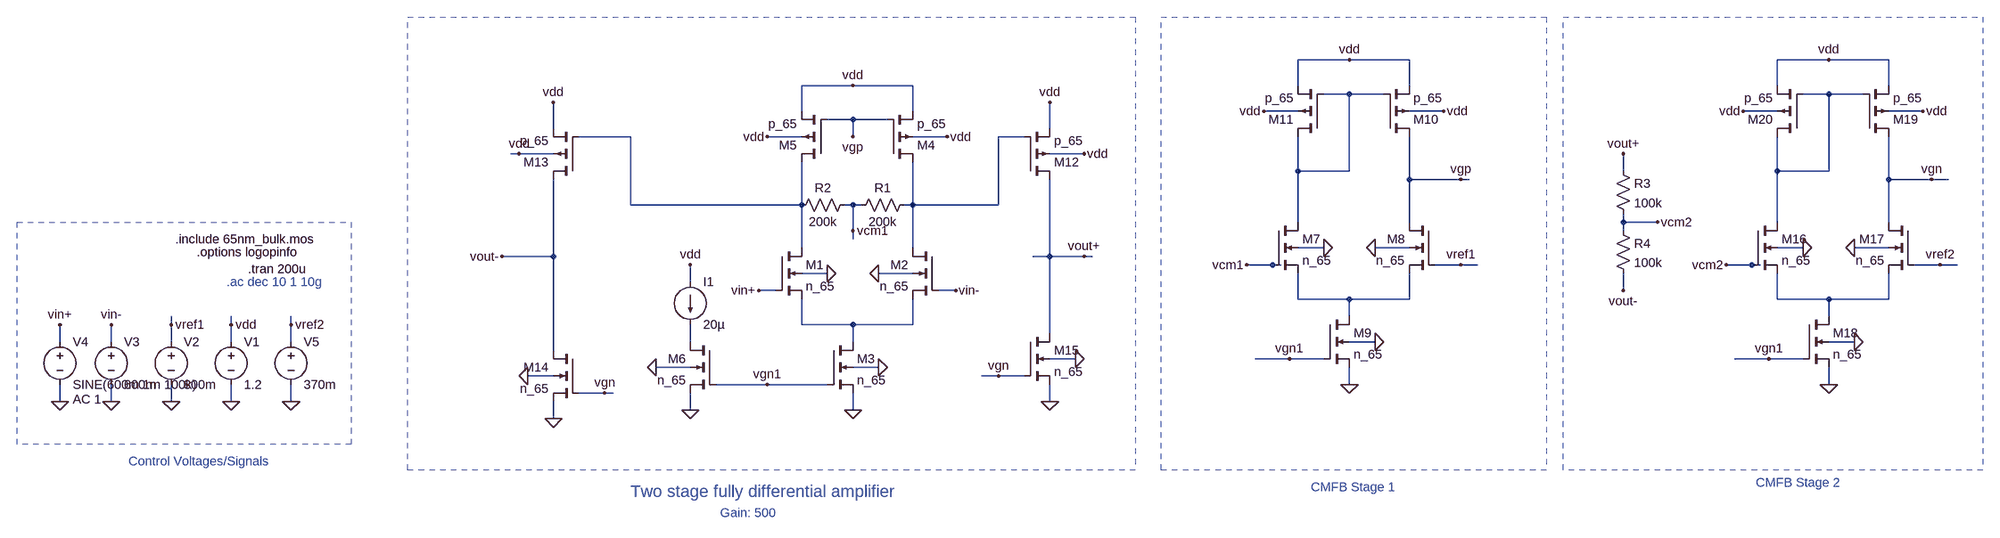
[diagram p0: schematic cmfb.asc]
cmfb.asc, the LTspice schematic file:
Version 4.1
SHEET 1 2388 772
WIRE 1200 -112 1104 -112
WIRE 1312 -112 1200 -112
WIRE 2096 -112 2000 -112
WIRE 2208 -112 2096 -112
WIRE 272 -64 176 -64
WIRE 384 -64 272 -64
WIRE 1104 -64 1104 -112
WIRE 1312 -64 1312 -112
WIRE 2000 -64 2000 -112
WIRE 2208 -64 2208 -112
WIRE 1200 -48 1152 -48
WIRE 1264 -48 1200 -48
WIRE 2096 -48 2048 -48
WIRE 2160 -48 2096 -48
WIRE 176 -16 176 -64
WIRE 384 -16 384 -64
WIRE 1104 -16 1040 -16
WIRE 1376 -16 1312 -16
WIRE 2000 -16 1936 -16
WIRE 2272 -16 2208 -16
WIRE 272 0 224 0
WIRE 336 0 272 0
WIRE -288 16 -288 -32
WIRE 640 16 640 -32
WIRE -144 32 -240 32
WIRE 176 32 112 32
WIRE 272 32 272 0
WIRE 448 32 384 32
WIRE 592 32 544 32
WIRE -352 64 -368 64
WIRE -288 64 -352 64
WIRE 704 64 640 64
WIRE 1104 96 1104 32
WIRE 1200 96 1200 -48
WIRE 1200 96 1104 96
WIRE 1712 96 1712 64
WIRE 2000 96 2000 32
WIRE 2096 96 2096 -48
WIRE 2096 96 2000 96
WIRE 1312 112 1312 32
WIRE 1408 112 1312 112
WIRE 1424 112 1408 112
WIRE 2208 112 2208 32
WIRE 2288 112 2208 112
WIRE 2320 112 2288 112
WIRE -144 160 -144 32
WIRE 176 160 176 80
WIRE 176 160 -144 160
WIRE 272 160 256 160
WIRE 288 160 272 160
WIRE 384 160 384 80
WIRE 384 160 368 160
WIRE 544 160 544 32
WIRE 544 160 384 160
WIRE 1104 192 1104 96
WIRE 1312 192 1312 112
WIRE 1712 192 1712 176
WIRE 1776 192 1712 192
WIRE 2000 192 2000 96
WIRE 2208 192 2208 112
WIRE 272 208 272 160
WIRE 1712 208 1712 192
WIRE 272 224 272 208
WIRE 176 240 176 160
WIRE 384 240 384 160
WIRE 1152 240 1104 240
WIRE 1312 240 1248 240
WIRE 2048 240 2000 240
WIRE 2208 240 2144 240
WIRE -288 256 -288 112
WIRE -288 256 -384 256
WIRE 640 256 640 112
WIRE 640 256 608 256
WIRE 704 256 640 256
WIRE 720 256 704 256
WIRE 1056 272 1008 272
WIRE 1072 272 1056 272
WIRE 1408 272 1360 272
WIRE 1440 272 1408 272
WIRE 1952 272 1904 272
WIRE 1968 272 1952 272
WIRE 2304 272 2256 272
WIRE 2336 272 2304 272
WIRE 224 288 176 288
WIRE 384 288 320 288
WIRE -32 304 -32 272
WIRE 128 320 96 320
WIRE 464 320 432 320
WIRE 1712 320 1712 288
WIRE 1104 336 1104 288
WIRE 1200 336 1104 336
WIRE 1312 336 1312 288
WIRE 1312 336 1200 336
WIRE 2000 336 2000 288
WIRE 2096 336 2000 336
WIRE 2208 336 2208 288
WIRE 2208 336 2096 336
WIRE 1200 368 1200 336
WIRE 2096 368 2096 336
WIRE -1184 384 -1184 368
WIRE -1072 384 -1072 368
WIRE -960 384 -960 368
WIRE 176 384 176 336
WIRE 272 384 176 384
WIRE 384 384 384 336
WIRE 384 384 272 384
WIRE 640 400 640 256
WIRE -1392 416 -1392 384
WIRE -1296 416 -1296 384
WIRE -1184 416 -1184 384
WIRE -1072 416 -1072 384
WIRE -960 416 -960 384
WIRE -32 416 -32 384
WIRE 272 416 272 384
WIRE 1248 416 1200 416
WIRE 2144 416 2096 416
WIRE -288 432 -288 256
WIRE 688 448 640 448
WIRE 1088 448 1024 448
WIRE 1152 448 1088 448
WIRE 1984 448 1920 448
WIRE 2048 448 1984 448
WIRE -32 464 -96 464
WIRE 320 464 272 464
WIRE -288 480 -336 480
WIRE 544 480 512 480
WIRE 592 480 544 480
WIRE 112 496 16 496
WIRE 224 496 112 496
WIRE 1200 496 1200 464
WIRE 2096 496 2096 464
WIRE -192 512 -240 512
WIRE -176 512 -192 512
WIRE -1392 528 -1392 496
WIRE -1296 528 -1296 496
WIRE -1184 528 -1184 496
WIRE -1072 528 -1072 496
WIRE -960 528 -960 496
WIRE 640 528 640 496
WIRE -32 544 -32 512
WIRE 272 544 272 512
WIRE -288 560 -288 528
FLAG 224 288 0
FLAG 320 288 0
FLAG 320 464 0
FLAG 272 544 0
FLAG 96 320 vin+
FLAG 464 320 vin-
FLAG 448 32 vdd
FLAG 112 32 vdd
FLAG 272 -64 vdd
FLAG -32 544 0
FLAG -96 464 0
FLAG -32 272 vdd
FLAG -1072 528 0
FLAG -1072 384 vdd
FLAG 1152 240 0
FLAG 1248 240 0
FLAG 1248 416 0
FLAG 1200 496 0
FLAG 1376 -16 vdd
FLAG 1040 -16 vdd
FLAG 1200 -112 vdd
FLAG 1408 112 vgp
FLAG -1184 528 0
FLAG -1184 384 vref1
FLAG 1408 272 vref1
FLAG -1296 528 0
FLAG -1392 528 0
FLAG -1392 384 vin+
FLAG -1296 384 vin-
FLAG -352 64 vdd
FLAG 704 64 vdd
FLAG -336 480 0
FLAG -288 560 0
FLAG 688 448 0
FLAG 640 528 0
FLAG 640 -32 vdd
FLAG -288 -32 vdd
FLAG -384 256 vout-
FLAG 272 208 vcm1
FLAG 272 32 vgp
FLAG 1008 272 vcm1
FLAG 704 256 vout+
FLAG -960 528 0
FLAG -960 384 vref2
FLAG 1088 448 vgn1
FLAG 112 496 vgn1
FLAG -192 512 vgn
FLAG 2048 240 0
FLAG 2144 240 0
FLAG 2144 416 0
FLAG 2096 496 0
FLAG 2272 -16 vdd
FLAG 1936 -16 vdd
FLAG 2096 -112 vdd
FLAG 2304 272 vref2
FLAG 1904 272 vcm2
FLAG 1984 448 vgn1
FLAG 544 480 vgn
FLAG 2288 112 vgn
FLAG 1776 192 vcm2
FLAG 1712 64 vout+
FLAG 1712 320 vout-
SYMBOL nmos4 128 240 R0
SYMATTR InstName M1
SYMATTR Value n_65
SYMATTR Value2 l=180n w=10u
SYMBOL nmos4 432 240 M0
SYMATTR InstName M2
SYMATTR Value n_65
SYMATTR Value2 l=180n w=10u
SYMBOL nmos4 224 416 R0
SYMATTR InstName M3
SYMATTR Value n_65
SYMATTR Value2 l=300n w=10u
SYMBOL pmos4 336 80 M180
SYMATTR InstName M4
SYMATTR Value p_65
SYMATTR Value2 l=200n w=10u
SYMBOL pmos4 224 80 R180
SYMATTR InstName M5
SYMATTR Value p_65
SYMATTR Value2 l=200n w=10u
SYMBOL nmos4 16 416 M0
SYMATTR InstName M6
SYMATTR Value n_65
SYMATTR Value2 l=300n w=10u
SYMBOL current -32 304 R0
WINDOW 123 0 0 Left 0
WINDOW 39 0 0 Left 0
SYMATTR InstName I1
SYMATTR Value 20µ
SYMBOL voltage -1072 400 R0
WINDOW 123 0 0 Left 0
WINDOW 39 0 0 Left 0
SYMATTR InstName V1
SYMATTR Value 1.2
SYMBOL nmos4 1056 192 R0
SYMATTR InstName M7
SYMATTR Value n_65
SYMATTR Value2 l=180n w=10u
SYMBOL nmos4 1360 192 M0
SYMATTR InstName M8
SYMATTR Value n_65
SYMATTR Value2 l=180n w=10u
SYMBOL nmos4 1152 368 R0
SYMATTR InstName M9
SYMATTR Value n_65
SYMATTR Value2 l=300n w=10u
SYMBOL pmos4 1264 32 M180
SYMATTR InstName M10
SYMATTR Value p_65
SYMATTR Value2 l=200n w=5u
SYMBOL pmos4 1152 32 R180
SYMATTR InstName M11
SYMATTR Value p_65
SYMATTR Value2 l=200n w=5u
SYMBOL voltage -1184 400 R0
WINDOW 123 0 0 Left 0
WINDOW 39 0 0 Left 0
SYMATTR InstName V2
SYMATTR Value 800m
SYMBOL voltage -1296 400 R0
WINDOW 123 0 0 Left 0
WINDOW 39 0 0 Left 0
SYMATTR InstName V3
SYMATTR Value 600m
SYMBOL voltage -1392 400 R0
WINDOW 123 24 124 Left 2
WINDOW 39 0 0 Left 0
SYMATTR Value2 AC 1
SYMATTR InstName V4
SYMATTR Value SINE(600m 1m 100k)
SYMBOL pmos4 592 112 M180
SYMATTR InstName M12
SYMATTR Value p_65
SYMATTR Value2 l=300n w=20u
SYMBOL pmos4 -240 112 R180
SYMATTR InstName M13
SYMATTR Value p_65
SYMATTR Value2 l=300n w=20u
SYMBOL nmos4 -240 432 M0
SYMATTR InstName M14
SYMATTR Value n_65
SYMATTR Value2 l=300n w=10u
SYMBOL nmos4 592 400 R0
SYMATTR InstName M15
SYMATTR Value n_65
SYMATTR Value2 l=300n w=10u
SYMBOL res 384 144 R90
WINDOW 0 0 56 VBottom 2
WINDOW 3 32 56 VTop 2
SYMATTR InstName R1
SYMATTR Value 200k
SYMBOL res 272 144 R90
WINDOW 0 0 56 VBottom 2
WINDOW 3 32 56 VTop 2
SYMATTR InstName R2
SYMATTR Value 200k
SYMBOL voltage -960 400 R0
WINDOW 123 0 0 Left 0
WINDOW 39 0 0 Left 0
SYMATTR InstName V5
SYMATTR Value 370m
SYMBOL nmos4 1952 192 R0
SYMATTR InstName M16
SYMATTR Value n_65
SYMATTR Value2 l=180n w=10u
SYMBOL nmos4 2256 192 M0
SYMATTR InstName M17
SYMATTR Value n_65
SYMATTR Value2 l=180n w=10u
SYMBOL nmos4 2048 368 R0
SYMATTR InstName M18
SYMATTR Value n_65
SYMATTR Value2 l=300n w=10u
SYMBOL pmos4 2160 32 M180
SYMATTR InstName M19
SYMATTR Value p_65
SYMATTR Value2 l=200n w=5u
SYMBOL pmos4 2048 32 R180
SYMATTR InstName M20
SYMATTR Value p_65
SYMATTR Value2 l=200n w=5u
SYMBOL res 1696 80 R0
SYMATTR InstName R3
SYMATTR Value 100k
SYMBOL res 1696 192 R0
SYMATTR InstName R4
SYMATTR Value 100k
TEXT -1176 224 Left 2 !.include 65nm_bulk.mos
TEXT -1136 248 Left 2 !.options logopinfo
TEXT -1080 304 Left 2 ;.ac dec 10 1 10g
TEXT -1040 280 Left 2 !.tran 200u
TEXT -144 696 Left 3 ;Two stage fully differential amplifier
TEXT 24 736 Left 2 ;Gain: 500
TEXT 1128 688 Left 2 ;CMFB Stage 1
TEXT 1960 680 Left 2 ;CMFB Stage 2
TEXT -1264 640 Left 2 ;Control Voltages/Signals
RECTANGLE Normal 800 656 -560 -192 2
RECTANGLE Normal 1568 656 848 -192 2
RECTANGLE Normal 2384 656 1600 -192 2
RECTANGLE Normal -848 608 -1472 192 2

The netlist it stands for:
* cmfb.asc
M1 N003 vin+ N007 0 n_65 l=180n w=10u
M2 N004 vin- N007 0 n_65 l=180n w=10u
M3 N007 vgn1 0 0 n_65 l=300n w=10u
M4 N004 vgp vdd vdd p_65 l=200n w=10u
M5 N003 vgp vdd vdd p_65 l=200n w=10u
M6 N008 vgn1 0 0 n_65 l=300n w=10u
I1 vdd N008 20µ
V1 vdd 0 1.2
M7 N001 vcm1 N005 0 n_65 l=180n w=10u
M8 vgp vref1 N005 0 n_65 l=180n w=10u
M9 N005 vgn1 0 0 n_65 l=300n w=10u
M10 vgp N001 vdd vdd p_65 l=200n w=5u
M11 N001 N001 vdd vdd p_65 l=200n w=5u
V2 vref1 0 800m
V3 vin- 0 600m
V4 vin+ 0 SINE(600m 1m 100k) AC 1
M12 vout+ N004 vdd vdd p_65 l=300n w=20u
M13 vout- N003 vdd vdd p_65 l=300n w=20u
M14 vout- vgn 0 0 n_65 l=300n w=10u
M15 vout+ vgn 0 0 n_65 l=300n w=10u
R1 N004 vcm1 200k
R2 vcm1 N003 200k
V5 vref2 0 370m
M16 N002 vcm2 N006 0 n_65 l=180n w=10u
M17 vgn vref2 N006 0 n_65 l=180n w=10u
M18 N006 vgn1 0 0 n_65 l=300n w=10u
M19 vgn N002 vdd vdd p_65 l=200n w=5u
M20 N002 N002 vdd vdd p_65 l=200n w=5u
R3 vout+ vcm2 100k
R4 vcm2 vout- 100k
.model NMOS NMOS
.model PMOS PMOS
.lib standard.mos
.include 65nm_bulk.mos
.options logopinfo
* .ac dec 10 1 10g
.tran 200u
* Two stage fully differential amplifier
* Gain: 500
* CMFB Stage 1
* CMFB Stage 2
* Control Voltages/Signals
.backanno
.end